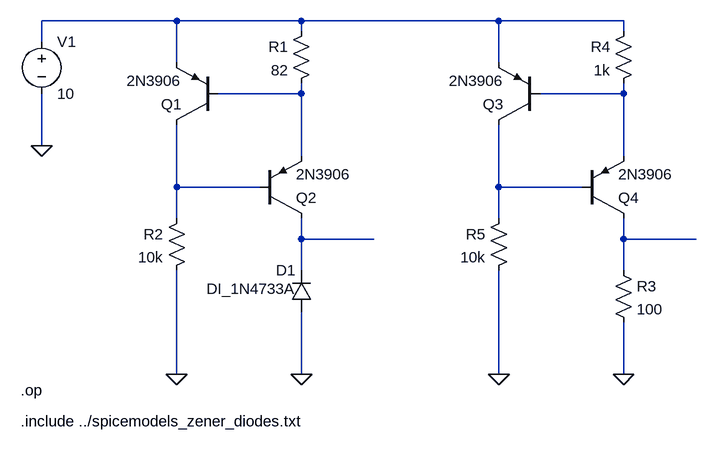
[diagram p0: schematic vref.asc]
vref.asc, the LTspice schematic file:
Version 4
SHEET 1 884 680
WIRE 16 -80 -192 -80
WIRE 208 -80 16 -80
WIRE 512 -80 208 -80
WIRE 704 -80 512 -80
WIRE 208 -64 208 -80
WIRE 704 -64 704 -80
WIRE -192 -48 -192 -80
WIRE 16 -16 16 -80
WIRE 512 -16 512 -80
WIRE 208 32 208 16
WIRE 208 32 80 32
WIRE 704 32 704 16
WIRE 704 32 576 32
WIRE -192 112 -192 32
WIRE 208 128 208 32
WIRE 704 128 704 32
WIRE 16 176 16 80
WIRE 144 176 16 176
WIRE 512 176 512 80
WIRE 640 176 512 176
WIRE 16 224 16 176
WIRE 512 224 512 176
WIRE 208 256 208 224
WIRE 320 256 208 256
WIRE 704 256 704 224
WIRE 816 256 704 256
WIRE 208 304 208 256
WIRE 704 304 704 256
WIRE 16 464 16 304
WIRE 208 464 208 368
WIRE 512 464 512 304
WIRE 704 464 704 384
FLAG -192 112 0
FLAG 16 464 0
FLAG 208 464 0
FLAG 512 464 0
FLAG 704 464 0
DATAFLAG 272 256 ""
DATAFLAG 768 256 ""
SYMBOL pnp 80 80 R180
SYMATTR InstName Q1
SYMATTR Value 2N3906
SYMBOL pnp 144 224 M180
SYMATTR InstName Q2
SYMATTR Value 2N3906
SYMBOL res 224 -80 M0
SYMATTR InstName R1
SYMATTR Value 82
SYMBOL voltage -192 -64 R0
WINDOW 123 0 0 Left 0
WINDOW 39 0 0 Left 0
SYMATTR InstName V1
SYMATTR Value 10
SYMBOL res 32 208 M0
SYMATTR InstName R2
SYMATTR Value 10k
SYMBOL res 688 288 R0
SYMATTR InstName R3
SYMATTR Value 100
SYMBOL pnp 576 80 R180
SYMATTR InstName Q3
SYMATTR Value 2N3906
SYMBOL pnp 640 224 M180
SYMATTR InstName Q4
SYMATTR Value 2N3906
SYMBOL res 720 -80 M0
SYMATTR InstName R4
SYMATTR Value 1k
SYMBOL res 528 208 M0
SYMATTR InstName R5
SYMATTR Value 10k
SYMBOL diode 224 368 R180
WINDOW 0 24 64 Left 2
WINDOW 3 24 36 Left 2
SYMATTR InstName D1
SYMATTR Value DI_1N4733A
SYMATTR Prefix X
TEXT -224 488 Left 2 !.op
TEXT -224 536 Left 2 !.include ../spicemodels_zener_diodes.txt

The netlist it stands for:
* vref.asc
Q1 N004 N002 N001 0 2N3906
Q2 N006 N004 N002 0 2N3906
R1 N001 N002 82
V1 N001 0 10
R2 N004 0 10k
R3 N007 0 100
Q3 N005 N003 N001 0 2N3906
Q4 N007 N005 N003 0 2N3906
R4 N001 N003 1k
R5 N005 0 10k
XD1 0 N006 DI_1N4733A  ; pins + -
.model NPN NPN
.model PNP PNP
.lib standard.bjt
.op
.include ../spicemodels_zener_diodes.txt
.backanno
.end